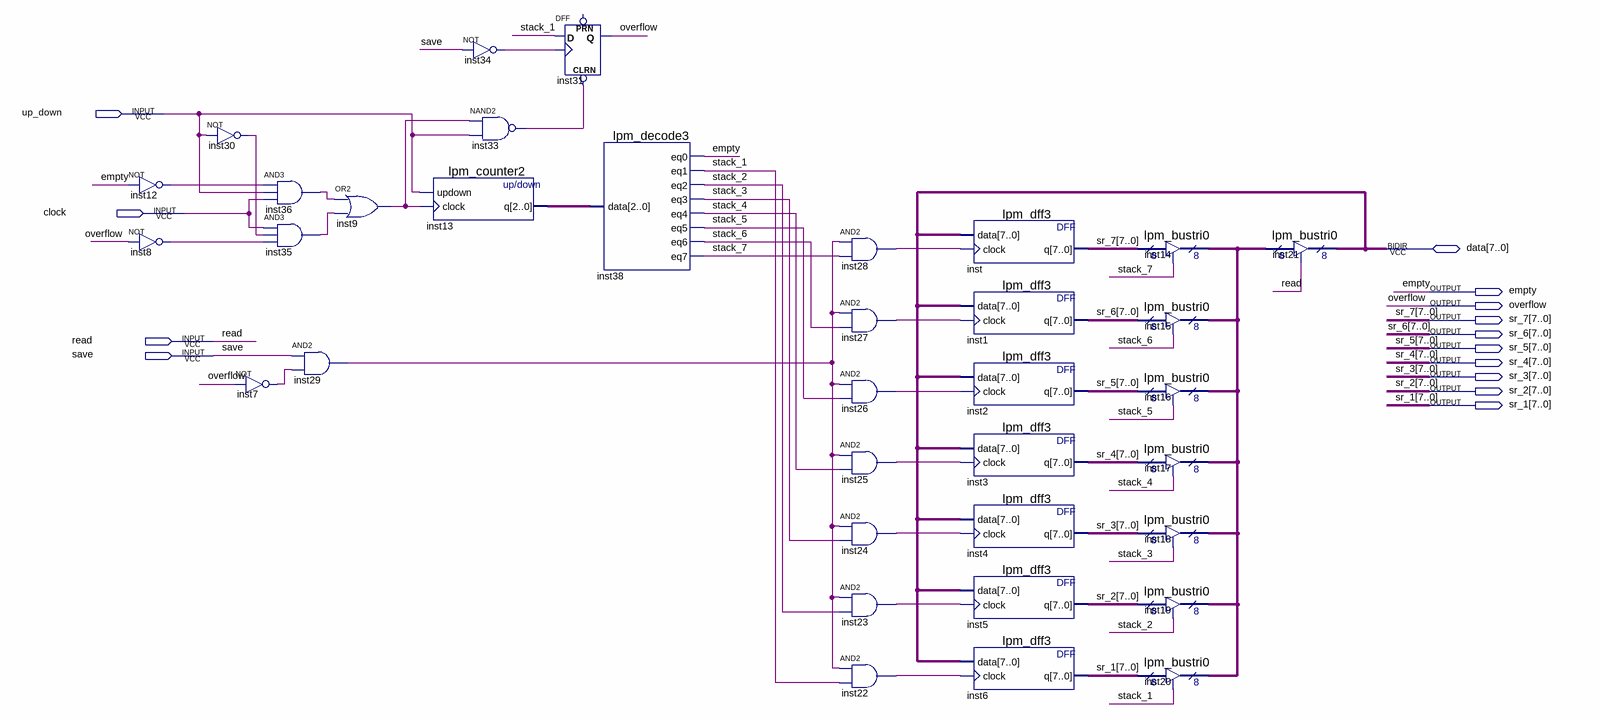
[diagram p0: schematic sheet]
// Quartus schematic stack.bdf as structural Verilog: 35 symbols, 14 pins
module stack (
  input  up_down,
  input  clock,
  input  read,
  input  save,
  inout  [7:0] data,
  output empty,
  output overflow,
  output [7:0] sr_7,
  output [7:0] sr_6,
  output [7:0] sr_5,
  output [7:0] sr_4,
  output [7:0] sr_3,
  output [7:0] sr_2,
  output [7:0] sr_1
);

  wire inst7_out, inst8_out, inst9_out, inst12_out, inst22_out, inst23_out, inst24_out, inst25_out,
       inst26_out, inst27_out, inst28_out, inst29_out, inst30_out, inst33_out, inst34_out, inst35_out,
       inst36_out, stack_1, stack_2, stack_3, stack_4, stack_5, stack_6, stack_7;
  wire [2:0] inst13_q;
  wire [7:0] inst14_tridata;

  not inst12 (inst12_out, empty);
  not inst8 (inst8_out, overflow);
  not inst30 (inst30_out, up_down);
  and inst36 (inst36_out, inst12_out, up_down, clock);
  and inst35 (inst35_out, clock, inst30_out, inst8_out);
  not inst7 (inst7_out, overflow);
  or inst9 (inst9_out, inst36_out, inst35_out);
  and inst29 (inst29_out, save, inst7_out);
  lpm_counter2 inst13 (.updown(up_down), .clock(inst9_out), .q(inst13_q));
  not inst34 (inst34_out, save);
  nand inst33 (inst33_out, inst9_out, up_down);
  DFF inst31 (.CLRN(inst33_out), .CLK(inst34_out), .D(stack_1), .Q(overflow));  // open: PRN
  lpm_decode3 inst38 (
    .data(inst13_q), .eq0(empty), .eq1(stack_1), .eq2(stack_2), .eq3(stack_3), .eq4(stack_4), .eq5(stack_5),
    .eq6(stack_6), .eq7(stack_7));
  and inst28 (inst28_out, inst29_out, stack_7);
  and inst27 (inst27_out, inst29_out, stack_6);
  and inst26 (inst26_out, inst29_out, stack_5);
  and inst25 (inst25_out, inst29_out, stack_4);
  and inst24 (inst24_out, inst29_out, stack_3);
  and inst23 (inst23_out, inst29_out, stack_2);
  and inst22 (inst22_out, inst29_out, stack_1);
  lpm_dff3 inst (.data(data), .clock(inst28_out), .q(sr_7));
  lpm_dff3 inst1 (.data(data), .clock(inst27_out), .q(sr_6));
  lpm_dff3 inst2 (.data(data), .clock(inst26_out), .q(sr_5));
  lpm_dff3 inst3 (.data(data), .clock(inst25_out), .q(sr_4));
  lpm_dff3 inst4 (.data(data), .clock(inst24_out), .q(sr_3));
  lpm_dff3 inst5 (.data(data), .clock(inst23_out), .q(sr_2));
  lpm_dff3 inst6 (.data(data), .clock(inst22_out), .q(sr_1));
  lpm_bustri0 inst14 (.enabledt(stack_7), .data(sr_7), .tridata(inst14_tridata));
  lpm_bustri0 inst15 (.enabledt(stack_6), .data(sr_6), .tridata(inst14_tridata));
  lpm_bustri0 inst16 (.enabledt(stack_5), .data(sr_5), .tridata(inst14_tridata));
  lpm_bustri0 inst17 (.enabledt(stack_4), .data(sr_4), .tridata(inst14_tridata));
  lpm_bustri0 inst18 (.enabledt(stack_3), .data(sr_3), .tridata(inst14_tridata));
  lpm_bustri0 inst19 (.enabledt(stack_2), .data(sr_2), .tridata(inst14_tridata));
  lpm_bustri0 inst20 (.enabledt(stack_1), .data(sr_1), .tridata(inst14_tridata));
  lpm_bustri0 inst21 (.enabledt(read), .data(inst14_tridata), .tridata(data));
endmodule
